# Altium schematic sheet FMU_Power_FMU_REV_1B.SchDoc: The Cube TM
size A3; Date: 18/08/2014 1:53:18 PM; DrawnBy: Philip Rowse; SheetNumber: 5; SheetTotal: 10
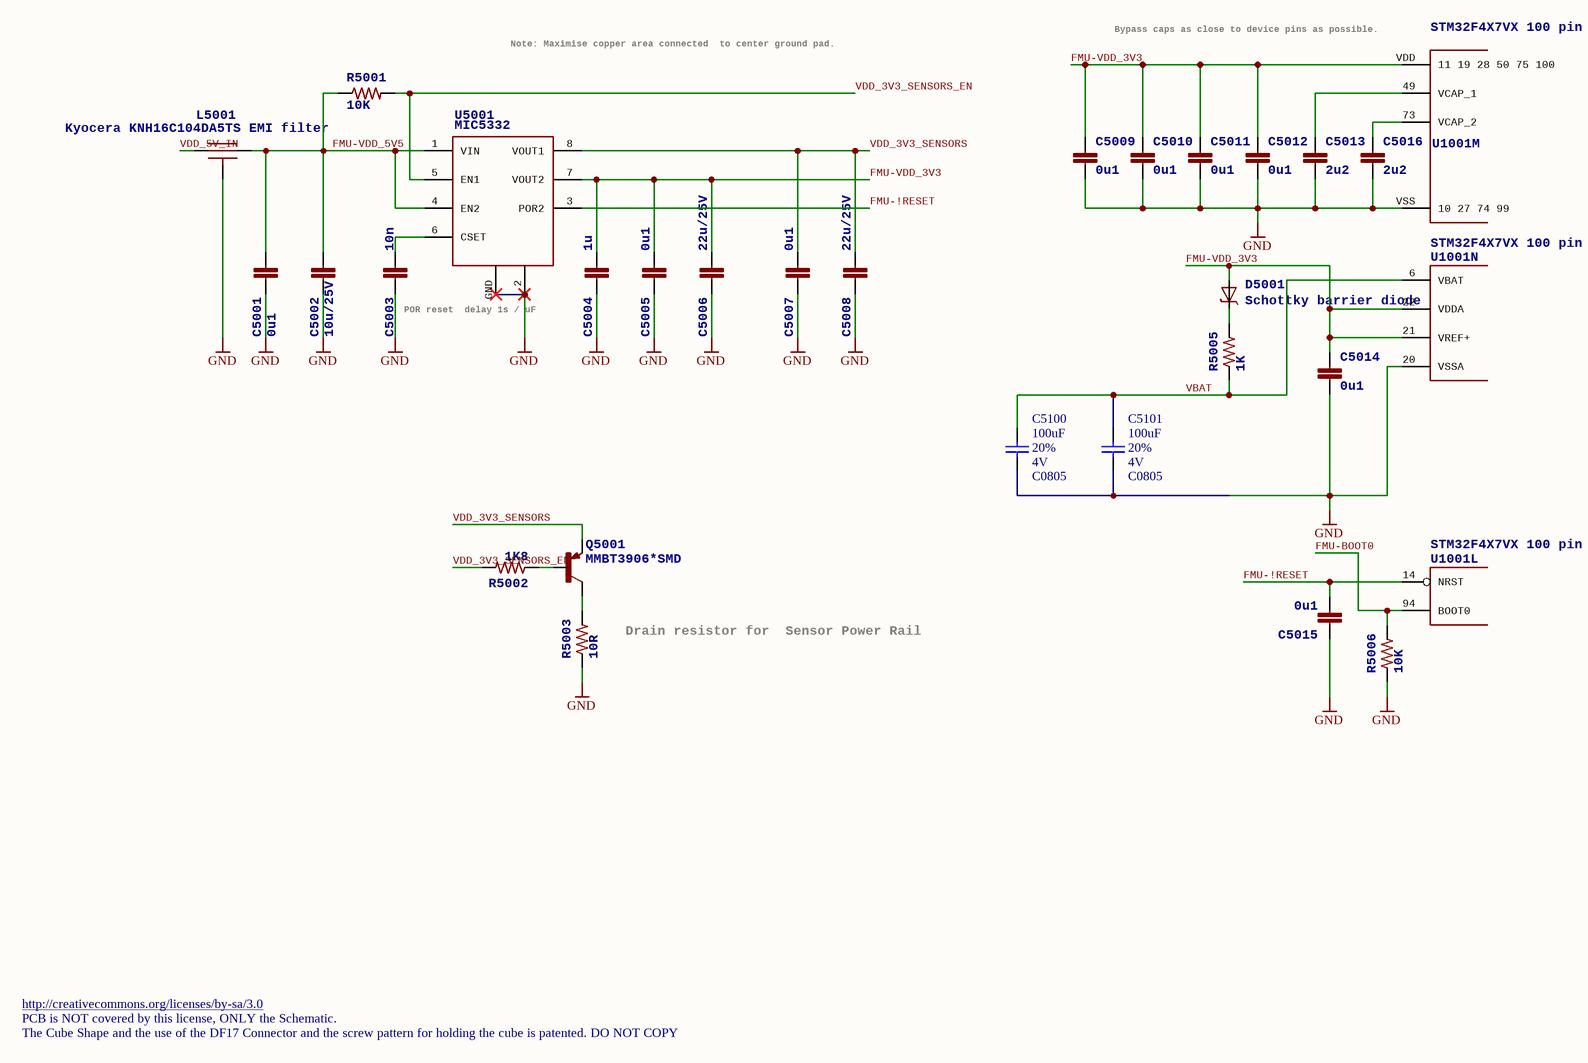
[diagram p0: FMU_Power_FMU_REV_1B.SchDoc]

## Parts
C5001  0u1  [0402-CAP]
C5002  10u/25V  [0805-CAP]
C5003  10n  [0402-CAP]
C5004  1u  [0603-CAP]
C5005  0u1  [0402-CAP]
C5006  22u/25V  [0805-CAP]
C5007  0u1  [0402-CAP]
C5008  22u/25V  [0805-CAP]
C5009  0u1  [0402-CAP]
C5010  0u1  [0402-CAP]
C5011  0u1  [0402-CAP]
C5012  0u1  [0402-CAP]
C5013  2u2  [0603-CAP]
C5014  0u1  [0402-CAP]
C5015  0u1  [0402-CAP]
C5016  2u2  [0603-CAP]
C5100  value 100uF  Tolerance: 20%  Voltage: 4V  [C0805]  (hidden comment: GRM21BR60G107ME15L)
C5101  value 100uF  Tolerance: 20%  Voltage: 4V  [C0805]  (hidden comment: GRM21BR60G107ME15L)
D5001  Schottky barrier diode  [SOD323]
L5001  Kyocera KNH16C104DA5TS EMI filter  [KYOCERA-KNH16-DA]
Q5001  MMBT3906*SMD  [SOT23-BEC]
R5001  10K  [0402-RES]
R5002  1K8  [0402-RES]
R5003  10R  [0603-RES]
R5005  1K  [0402-RES]
R5006  10K  [0402-RES]
U1001  STM32F4X7VX 100 pin  [TQFP100]  (parts L,M,N of 14)
U5001  MIC5332  [MLF-8-EPAD]

## Nets
GND: C5001.P$2 C5002.P$2 C5003.P$1 C5004.P$2 C5005.P$2 C5006.P$2 C5007.P$2 C5008.P$2 C5009.P$2 C5010.P$2 C5011.P$2 C5012.P$2 C5013.P$2 C5014.P$2 C5015.P$1 C5016.P$2 C5100.1 C5101.1 L5001.GND R5003.1 R5006.P$1 U1001.20(VSSA) U1001.VSS(10_27_74_99) U5001.2(GND) U5001.GND
FMU-!RESET: C5015.P$2 U1001.14(NRST) U5001.3(POR2)
FMU-BOOT0: R5006.P$2 U1001.94(BOOT0)
FMU-VDD_3V3: C5004.P$1 C5005.P$1 C5006.P$1 C5009.P$1 C5010.P$1 C5011.P$1 C5012.P$1 C5014.P$1 D5001.A U1001.21(VREF+) U1001.22(VDDA) U1001.VDD(11_19_28_50_75_100) U5001.7(VOUT2)
FMU-VDD_5V5: C5001.P$1 C5002.P$1 L5001.P$2 R5001.P$1 U5001.1(VIN) U5001.4(EN2)
VBAT: C5100.2 C5101.2 R5005.P$1 U1001.6(VBAT)
VDD_3V3_SENSORS: C5007.P$1 C5008.P$1 Q5001.E U5001.8(VOUT1)
VDD_3V3_SENSORS_EN: R5001.P$2 R5002.P$2 U5001.5(EN1)
VDD_5V_IN: L5001.P$1
NetC5003_P$2: C5003.P$2 U5001.6(CSET)
NetC5013_P$1: C5013.P$1 U1001.49(VCAP_1)
NetC5016_P$1: C5016.P$1 U1001.73(VCAP_2)
NetD5001_C: D5001.C R5005.P$2
NetQ5001_B: Q5001.B R5002.P$1
NetQ5001_C: Q5001.C R5003.2

## Notes on the sheet
- Note: Maximise copper area connected
  to center ground pad.
- Bypass caps as close to device pins as possible.
- POR reset
  delay 1s / uF
- Drain resistor for
  Sensor Power Rail
- http://creativecommons.org/licenses/by-sa/3.0
- PCB is NOT covered by this license, ONLY the Schematic.
- The Cube Shape and the use of the DF17 Connector and the screw pattern for holding the cube is patented. DO NOT COPY
- Title
- Size:
- Date:
- A3
- Number:
- Time:
- Revision:
- Sheet
- of
- File:

## Library data of the parts
C5001 C5005 C5007 C5009-C5012 C5014 C5015 = CAP0402: CAP CER 0.1UF 16V Y5V 0402; Value: 0u1
C5002 = CAP0805: CAP CER 10UF 25V 10% X5R 0805; Value: 10u/25
C5003 = CAP0402: CAP CER 10000PF 16V 10% X7R 0402; Value: 10n
C5004 = CAP0603: CAP CER 1UF 16V Y5V 0603; Value: 1u
C5006 C5008 = CAP0805: CAP CER 22UF 25V 20% X5R 0805; Value: 22u/25V
C5013 C5016 = CAP0603: CAP CER 2.2UF 16V 10% X6S 0603; Value: 2u2
C5100 C5101 = Capacitor
D5001 = DIODE-SCHOTTKY_SOD323: DIODE SCHOTTKY 30V 0.03A SOD323; Value: 30V
L5001 = KNH16C104DA5TS: FILTER CAP 0.1UF 2A 25V 0603; Value: 0u1
Q5001 = MMBT3906*SMD: TRANSISTOR SWITCHING PNP SOT-23
R5001 R5006 = RESISTOR0402-RES: RES 10K OHM 1/16W 1% 0402 SMD; Value: 10K
R5002 = RESISTOR0402-RES: RES 1.8K OHM 1/16W 1% 0402; Value: 1K8
R5003 = RESISTOR0603-RES: RES 10 OHM 1/10W 5% 0603; Value: 10R
R5005 = RESISTOR0402-RES: RES 1K OHM 1/16W 1% 0402; Value: 1K
U1001 = STM32F4X7VX: REV 3 Silicon or later IC MCU ARM 2MB FLASH 100LQFP
U5001 = MIC5332: IC REG LDO 3.3V 0.3A 8TMLF; Value: 3.3V